# EAGLE design Spannungsversorgung_FinalVersion (EAGLE 9.6.2)
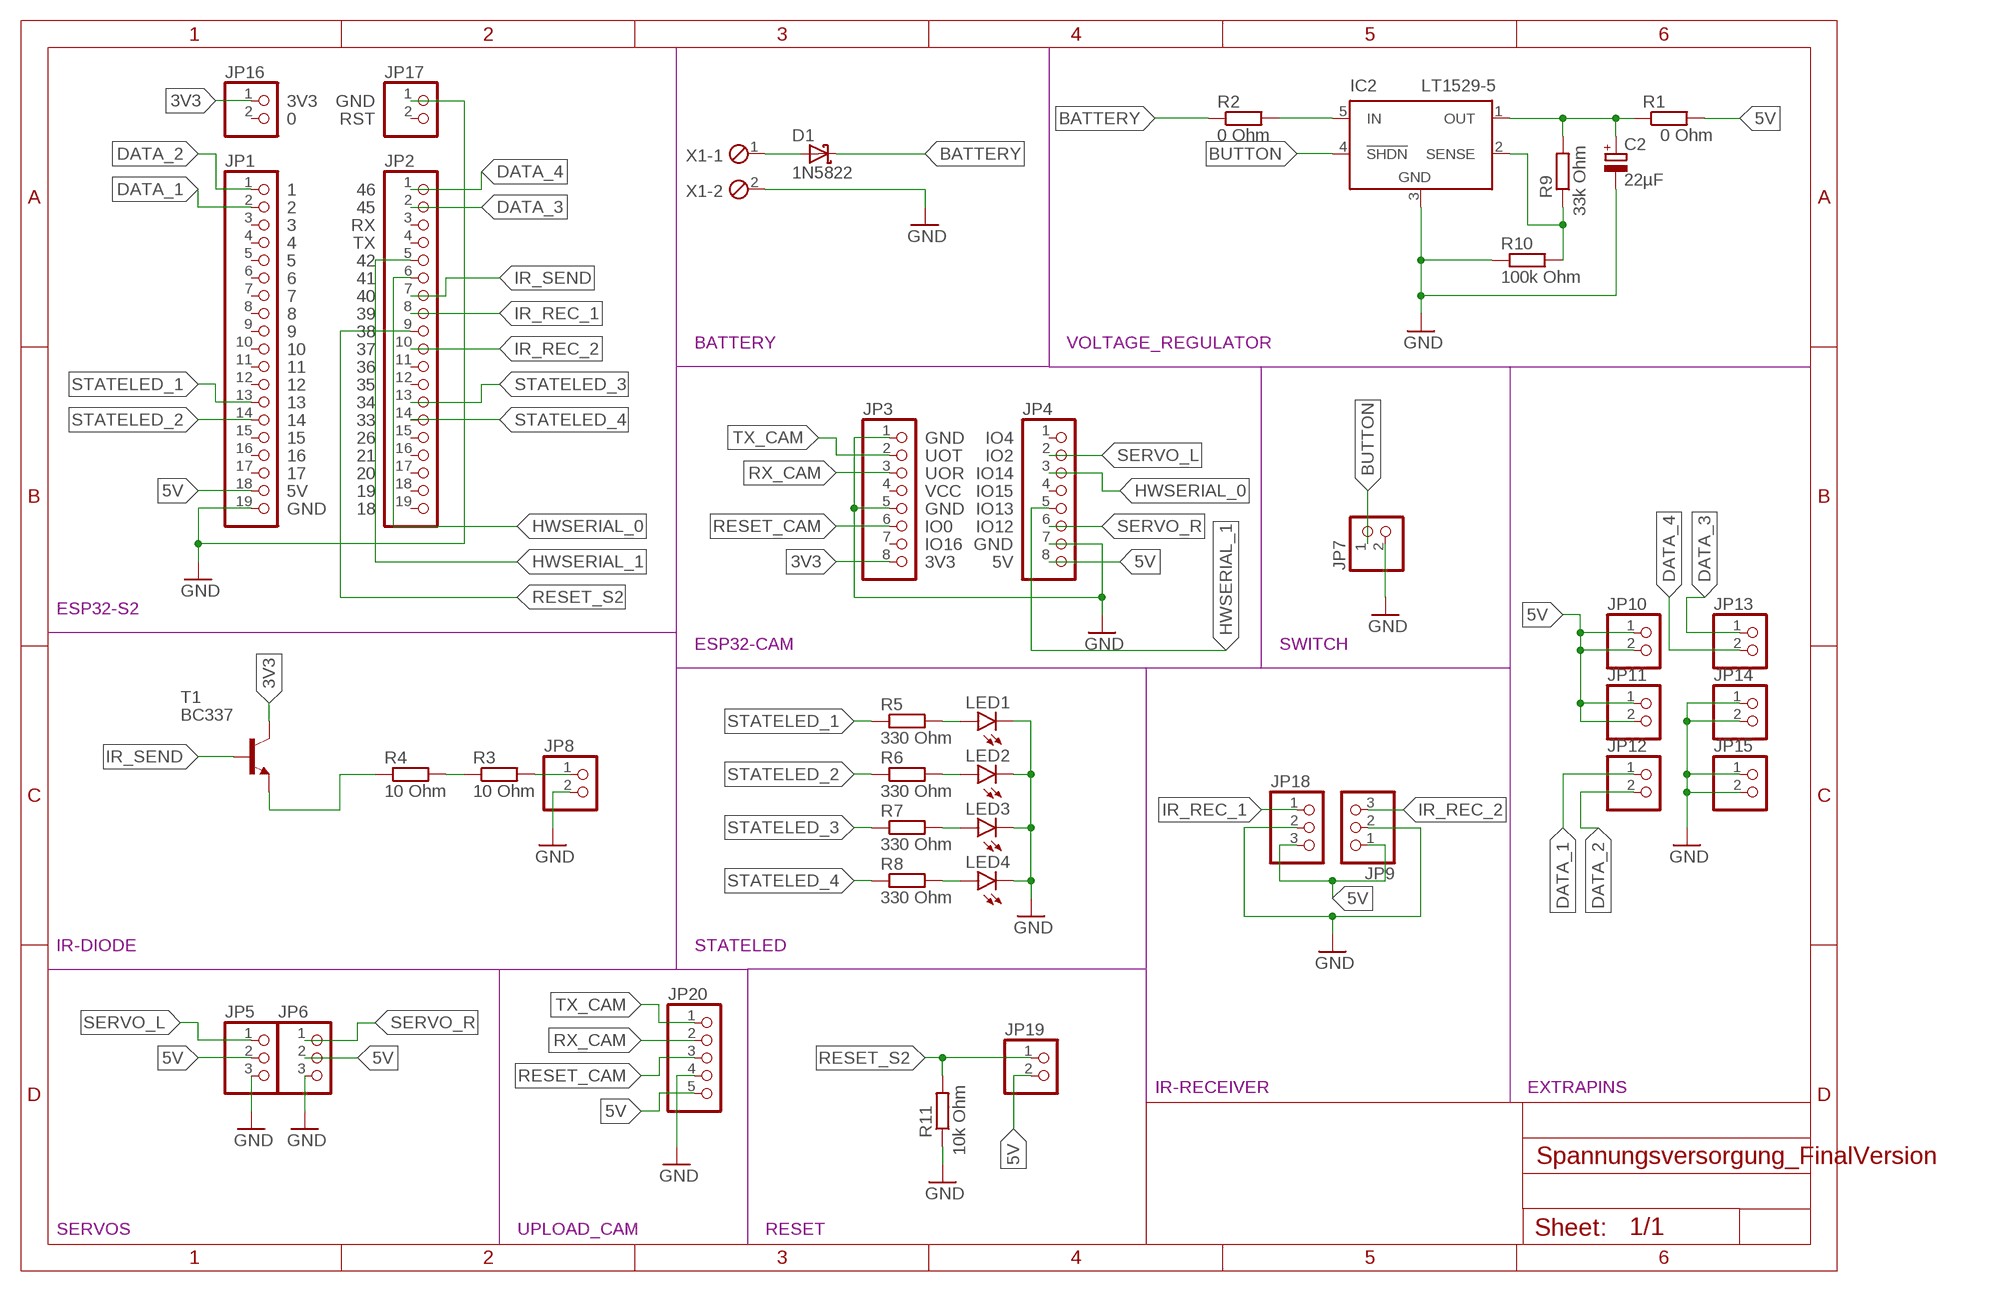
[diagram p0: schematic, sheet 1]

## Parts
C2  22µF  CPOL-EUE2.5-5  [E2,5-5]
D1  1N5822  [DIOAD2120W130L950D530P]
IC2  LT1529-5  LT1529T  [TO220-5]
JP1  PINHD-1X19  [1X19]
JP2  PINHD-1X19  [1X19]
JP3  PINHD-1X8  [1X08]
JP4  PINHD-1X8  [1X08]
JP5  PINHD-1X3  [1X03]
JP6  PINHD-1X3  [1X03]
JP7  PINHD-1X2  [1X02]
JP8  PINHD-1X2  [1X02]
JP9  PINHD-1X3  [1X03]
JP10  PINHD-1X2  [1X02]
JP11  PINHD-1X2  [1X02]
JP12  PINHD-1X2  [1X02]
JP13  PINHD-1X2  [1X02]
JP14  PINHD-1X2  [1X02]
JP15  PINHD-1X2  [1X02]
JP16  PINHD-1X2  [1X02]
JP17  PINHD-1X2  [1X02]
JP18  PINHD-1X3  [1X03]
JP19  PINHD-1X2  [1X02]
JP20  PINHD-1X5  [1X05]
LED1  LED3MM  [LED3MM]
LED2  LED3MM  [LED3MM]
LED3  LED3MM  [LED3MM]
LED4  LED3MM  [LED3MM]
R1  0 Ohm  R-EU_R0805  [R0805]
R2  0 Ohm  R-EU_R0805  [R0805]
R3  10 Ohm  R-EU_0309/12  [0309/12]
R4  10 Ohm  R-EU_0309/12  [0309/12]
R5  330 Ohm  R-EU_R0805  [R0805]
R6  330 Ohm  R-EU_R0805  [R0805]
R7  330 Ohm  R-EU_R0805  [R0805]
R8  330 Ohm  R-EU_R0805  [R0805]
R9  33k Ohm  R-EU_0309/12  [0309/12]
R10  100k Ohm  R-EU_0309/12  [0309/12]
R11  10k Ohm  R-EU_0309/12  [0309/12]
T1  BC337  [TO92]
X1  MPT2  [2POL254]

## Nets
3V3: JP3.8 JP16.1 T1.3(C)
5V: JP1.18 JP4.8 JP5.2 JP6.2 JP9.1 JP10.1 JP10.2 JP11.1 JP11.2 JP18.3 JP19.2 JP20.5 R1.2
BATTERY: D1.C R2.1
BUTTON: IC2.4(!SHDN) JP7.1
DATA_1: JP1.2 JP12.1
DATA_2: JP1.1 JP12.2
DATA_3: JP2.2 JP13.1
DATA_4: JP2.1 JP13.2
GND: C2.- IC2.3(GND) JP1.19 JP3.1 JP3.5 JP4.7 JP5.3 JP6.3 JP7.2 JP8.2 JP9.2 JP14.1 JP14.2 JP15.1 JP15.2 JP17.1 JP18.2 JP20.4 LED1.K(C) LED2.K(C) LED3.K(C) LED4.K(C) R10.1 R11.1 X1.2
HWSERIAL_0: JP2.6 JP4.3
HWSERIAL_1: JP2.5 JP4.5
IR_REC_1: JP2.8 JP18.1
IR_REC_2: JP2.10 JP9.3
IR_SEND: JP2.7 T1.2(B)
N$1: R3.1 R4.2
N$2: JP8.1 R3.2
N$3: IC2.5(IN) R2.2
N$4: D1.A X1.1
N$5: LED1.A R5.2
N$6: LED2.A R6.2
N$7: LED3.A R7.2
N$8: LED4.A R8.2
N$11: R4.1 T1.1(E)
N$13: IC2.2(SENSE) R9.1 R10.2
N$14: C2.+ IC2.1(OUT) R1.1 R9.2
RESET_CAM: JP3.6 JP20.3
RESET_S2: JP2.9 JP19.1 R11.2
RX_CAM: JP3.3 JP20.2
SERVO_L: JP4.2 JP5.1
SERVO_R: JP4.6 JP6.1
STATELED_1: JP1.13 R5.1
STATELED_2: JP1.14 R6.1
STATELED_3: JP2.13 R7.1
STATELED_4: JP2.14 R8.1
TX_CAM: JP3.2 JP20.1
Unconnected: JP1.3 JP1.4 JP1.5 JP1.6 JP1.7 JP1.8 JP1.9 JP1.10 JP1.11 JP1.12 JP1.15 JP1.16 JP1.17 JP2.3 JP2.4 JP2.11 JP2.12 JP2.15 JP2.16 JP2.17 JP2.18 JP2.19 JP3.4 JP3.7 JP4.1 JP4.4 JP16.2 JP17.2

## Notes on the sheet
- 3V3 | GND
- 0 | RST
- 1 | 46
- 2 | 45
- 3 | RX
- 4 | TX
- 5 | 42
- 6 | 41
- 7 | 40
- 8 | 39
- 9 | 38
- BATTERY | VOLTAGE_REGULATOR
- 10 | 37
- 11 | 36
- 12 | 35
- 13 | 34
- 14 | 33
- 15 | 26 | GND | IO4
- 16 | 21 | UOT | IO2
- 17 | 20 | UOR | IO14
- 5V | 19 | VCC | IO15
- GND | 18 | GND | IO13
- IO0 | IO12
- IO16 | GND
- 3V3 | 5V
- ESP32-S2
- ESP32-CAM | SWITCH
- IR-DIODE | STATELED
- IR-RECEIVER | EXTRAPINS
- SERVOS | UPLOAD_CAM | RESET

## Library data of the parts
C2 = rcl:CPOL-EU: POLARIZED CAPACITOR, European symbol; SPICEPREFIX: C
D1 = 1N5822:1N5822: 1N5822 Series 40 V 3 A Through Hole Schottky Rectifier - DO-201AD Check availability <https://pricing.snapeda.com/parts/1N5822/ON%20Semiconductor/view-part?ref=eda>; AVAILABILITY: In Stock; DESCRIPTION: DIODE, SCHOTTKY, 3A, 40V; Diode Type:Schottky; Diode Configuration:Single; Repetitive Reverse Voltage Vrrm Max:40V; Forward Current If(AV):3A; Forward Voltage VF Max:525mV; Forward Surge Current Ifsm Max:80A; Diode Case Style:DO-201AD; No. of Pins:2; SVHC:No SVHC (19-Dec-2011); Current Ifsm:80A; Device Marking:1N5822; Forward Current If Max:3A; Forward Voltage:525mV; Junction Temperature Tj Max:150°C; Package / Case:DO-201AD; RMS Current If:10A; Termination Type:Axial Leaded; MF: ON Semiconductor; MP: 1N5822; PACKAGE: AXIAL LEAD-2 ON Semiconductor; PRICE: None; PURCHASE-URL: https://pricing.snapeda.com/search/part/1N5822/?ref=eda
IC2 = ltc1440_lt1529_ds1302:LT1529: LT1529 5 Volt LDO Regulator 5 Volt, 3 Ampere Low Dropout voltage regulator.
JP1 JP2 = pinhead:PINHD-1X19: PIN HEADER
JP3 JP4 = pinhead:PINHD-1X8: PIN HEADER
JP5 JP6 JP9 JP18 = pinhead:PINHD-1X3: PIN HEADER
JP7 JP8 JP10-JP17 JP19 = pinhead:PINHD-1X2: PIN HEADER
JP20 = pinhead:PINHD-1X5: PIN HEADER
LED1-LED4 = led:LED: LED OSRAM: - CHIPLED LG R971, LG N971, LY N971, LG Q971, LY Q971, LO R971, LY R971 LH N974, LH R974 LS Q976, LO Q976, LY Q976 LO Q996 - Hyper CHIPLED LW Q18S LB Q993, LB Q99A, LB R99A - SideLED LS A670, LO A670, LY A670, LG A670, LP A670 LB A673, LV A673, LT A673, LW A673 LH A674 LY A675 LS A676, LA A676, LO A676, LY A676, LW A676 LS A679, LY A679, LG A679 - Hyper Micro SIDELED® LS Y876, LA Y876, LO Y876, LY Y876 LT Y87S - SmartLED LW L88C, LW L88S LB L89C, LB L89S, LG L890 LS L89K, LO L89K, LY L89K LS L896, LA L896, LO L896, LY L896 - TOPLED LS T670, LO T670, LY T670, LG T670, LP T670 LSG T670, LSP T670, LSY T670, LOP T670, LYG T670 LG T671, LOG T671, LSG T671 LB T673, LV T673, LT T673, LW T673 LH T674 LS T676, LA T676, LO T676, LY T676, LB T676, LH T676, LSB T676, LW T676 LB T67C, LV T67C, LT T67C, LS T67K, LO T67K, LY T67K, LW E67C LS E67B, LA E67B, LO E67B, LY E67B, LB E67C, LV E67C, LT E67C LW T67C LS T679, LY T679, LG T679 LS T770, LO T770, LY T770, LG T770, LP T770 LB T773, LV T773, LT T773, LW T773 LH T774 LS E675, LA E675, LY E675, LS T675 LS T776, LA T776, LO T776, LY T776, LB T776 LHGB T686 LT T68C, LB T68C - Hyper Mini TOPLED® LB M676 - Mini TOPLED Santana® LG M470 LS M47K, LO M47K, LY M47K Source: http://www.osram.convergy.de LUXEON: - LUMILED® LXK2-PW12-R00, LXK2-PW12-S00, LXK2-PW14-U00, LXK2-PW14-V00 LXK2-PM12-R00, LXK2-PM12-S00, LXK2-PM14-U00 LXK2-PE12-Q00, LXK2-PE12-R00, LXK2-PE12-S00, LXK2-PE14-T00, LXK2-PE14-U00 LXK2-PB12-K00, LXK2-PB12-L00, LXK2-PB12-M00, LXK2-PB14-N00, LXK2-PB14-P00, LXK2-PB14-Q00 LXK2-PR12-L00, LXK2-PR12-M00, LXK2-PR14-Q00, LXK2-PR14-R00 LXK2-PD12-Q00, LXK2-PD12-R00, LXK2-PD12-S00 LXK2-PH12-R00, LXK2-PH12-S00 LXK2-PL12-P00, LXK2-PL12-Q00, LXK2-PL12-R00 Source: www.luxeon.com KINGBRIGHT: KA-3528ASYC Source: www.kingbright.com
R1-R11 = rcl:R-EU_: RESISTOR, European symbol; SPICEPREFIX: R
T1 = transistor:BC337: NPN TRANSISTOR
X1 = con-phoenix-254:MPT2: PHOENIX CONNECTOR; OC_FARNELL: unknown; OC_NEWARK: unknown

## Board
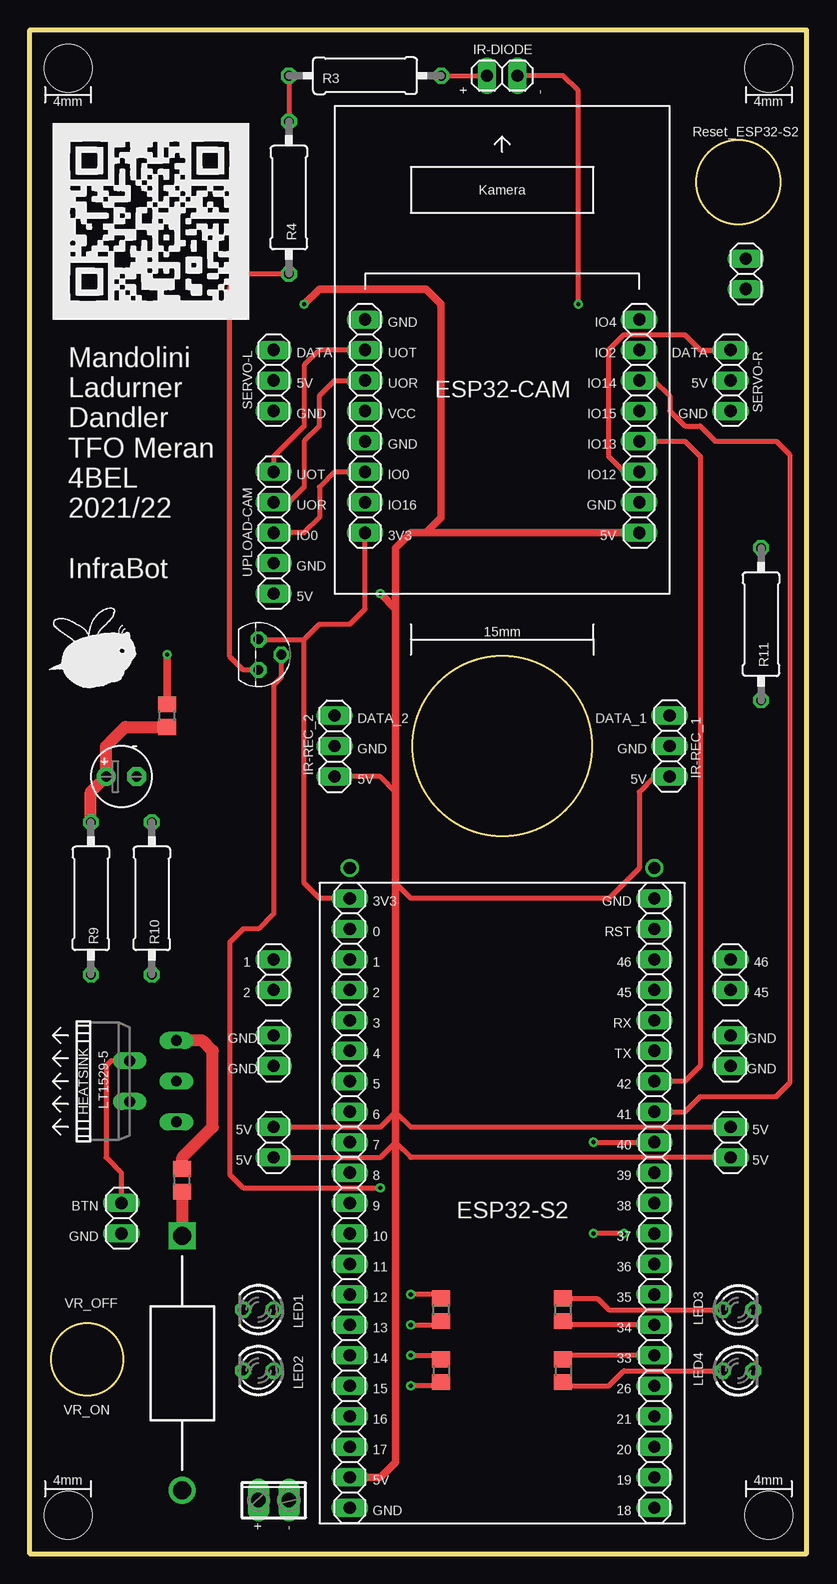
[diagram p1: board, top side]
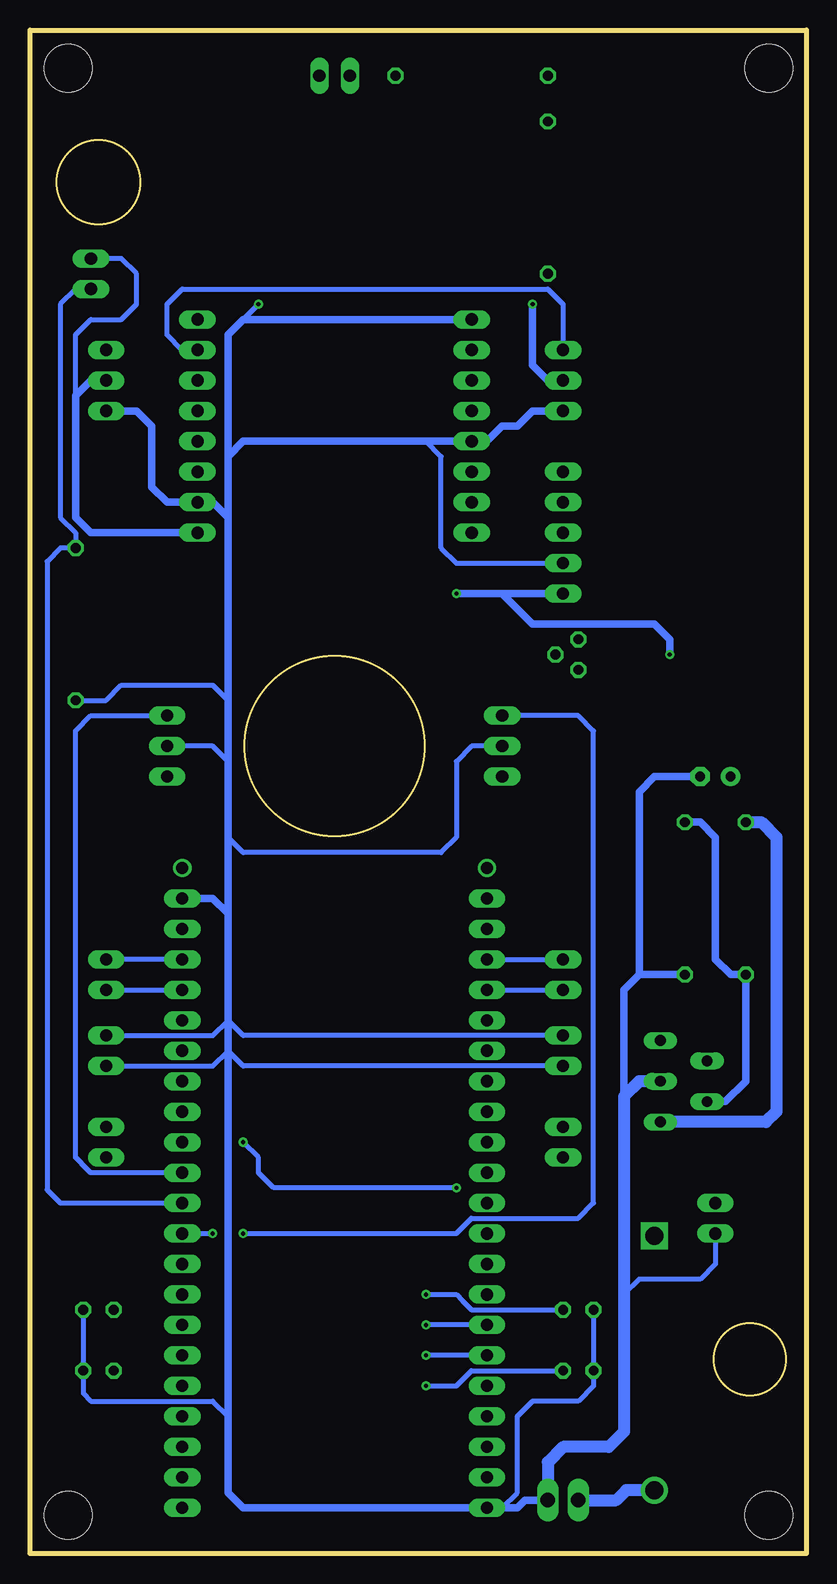
[diagram p2: board, bottom side, seen from below]

Size 64.77 x 127 mm. Coordinates in mm from the lower left corner, seen from the top.
Outline: 0,0 64.77,0 64.77,127 0,127 0,0
Copper layers (1*16): Top 0.035mm / dielectric 1.5mm / Bottom 0.035mm
Design rules "default *": minimum track width 6mil, minimum drill 0.35mm, track to track 12mil, track to pad 12mil, pad to pad 12mil, via to via 12mil, smd to smd 12mil, copper to edge 40mil, drill to drill 12mil, minimum pad ring 10mil, minimum via ring 8mil, stop-mask expansion 4mil, vias tented up to drill 0mil, thermal gap 10mil
Holes 4 mm at 3.18,123.82 61.59,123.82 3.18,3.17 61.59,3.17
Milling: area 31.9,59.8 to 46.9,74.8; area 1.8,13.2 to 7.8,19.2; area 55.6,110.8 to 62.6,117.8

### Footprints (pad centres in the part's own frame; a part is rotated, then mirrored left to right if it is on the bottom)
E2,5-5 = drill 0.813 pad 1.6: + -1.27,0 | drill 0.813 pad 1.6 octagon: - 1.27,0
DIOAD2120W130L950D530P = drill 1.5 pad 2.25: A 10.6,0 | drill 1.5 pad 2.25 square: C -10.6,0
TO220-5 = drill 0.9 long: 1 -3.4,-8.4; 2 -1.7,-4.5; 3 0,-8.4; 4 1.7,-4.5; 5 3.4,-8.4
1X19 = drill 1.016 long: 1 -22.86,0; 2 -20.32,0; 3 -17.78,0; 4 -15.24,0; 5 -12.7,0; 6 -10.16,0; 7 -7.62,0; 8 -5.08,0; 9 -2.54,0; 10 0,0; 11 2.54,0; 12 5.08,0; 13 7.62,0; 14 10.16,0; 15 12.7,0; 16 15.24,0; 17 17.78,0; 18 20.32,0; 19 22.86,0
1X08 = drill 1.016 long: 1 -8.89,0; 2 -6.35,0; 3 -3.81,0; 4 -1.27,0; 5 1.27,0; 6 3.81,0; 7 6.35,0; 8 8.89,0
1X03 = drill 1.016 long: 1 -2.54,0; 2 0,0; 3 2.54,0
1X02 = drill 1.016 long: 1 -1.27,0; 2 1.27,0
1X05 = drill 1.016 long: 1 -5.08,0; 2 -2.54,0; 3 0,0; 4 2.54,0; 5 5.08,0
LED3MM = drill 0.813 octagon: A -1.27,0; K 1.27,0
R0805 = smd 1.3 x 1.5: 1 -0.95,0; 2 0.95,0
0309/12 = drill 0.813 octagon: 1 -6.35,0; 2 6.35,0
TO92 = drill 0.813 octagon: 1 1.27,0; 2 0,1.905; 3 -1.27,0
2POL254 = drill 1.2 long: 1 -1.27,0; 2 1.27,0

### Placement (x,y rotation side)
C2  7.62,64.77 0 top
D1  12.7,15.88 270 top
IC2  3.81,39.37 90 top
JP1  26.67,26.67 270 top
JP2  52.07,26.67 270 top
JP3  27.94,93.98 270 top
JP4  50.8,93.98 270 top
JP5  20.32,97.79 270 top
JP6  58.42,97.79 270 top
JP7  7.62,27.94 270 top
JP8  39.37,123.19 0 top
JP9  25.4,67.31 90 top
JP10  20.32,34.29 90 top
JP11  58.42,34.29 90 top
JP12  20.32,48.26 90 top
JP13  58.42,48.26 90 top
JP14  20.32,41.91 90 top
JP15  58.42,41.91 90 top
JP16  26.67,53.34 270 top
JP17  52.07,53.34 270 top
JP18  53.34,67.31 270 top
JP19  59.69,106.68 90 top
JP20  20.32,85.09 270 top
LED1  19.05,20.32 180 top
LED2  19.05,15.24 180 top
LED3  59.05,20.32 0 top
LED4  59.05,15.24 0 top
R1  11.43,69.85 90 top
R2  12.69,31.12 90 top
R3  27.94,123.19 0 top
R4  21.59,113.03 90 top
R5  34.29,20.32 90 top
R6  34.29,15.24 270 top
R7  44.45,20.32 90 top
R8  44.45,15.24 270 top
R9  5.08,54.61 90 top
R10  10.16,54.61 90 top
R11  60.96,77.47 90 top
T1  19.05,74.93 270 top
X1  20.32,4.45 0 top

### Tracks (layer width: path | path; a pad name or v marks a point on that pad's centre or on a via)
3V3
  Top 0.406: 22.86,76.2 22.86,55.88 24.13,54.61 JP16.1 | 22.86,76.2 24.13,77.47 26.67,77.47 27.94,78.74 JP3.8 | T1.3 22.86,76.2
5V  (via drill 0.35)
  Top 0.406: JP10.2 29.21,35.56 30.48,36.83 31.75,35.56 JP11.2 | JP10.1 29.21,33.02 30.48,34.29 31.75,33.02 JP11.1 | 30.48,63.5 29.21,64.77 JP9.1 | 30.48,55.88 31.75,54.61 48.26,54.61 50.8,57.15 50.8,63.5 52.07,64.77 JP18.3
  Top 0.61: 33.02,85.09 31.75,85.09 30.48,83.82 30.48,78.74 | 33.02,85.09 JP4.8 | 30.48,78.74 30.48,63.5 30.48,55.88 30.48,36.83 30.48,34.29 30.48,7.62 29.21,6.35 JP1.18 | 33.02,85.09 34.29,86.36 34.29,104.14 33.02,105.41 24.13,105.41 v22.86,104.14 | 30.48,78.74 v29.21,80.01 | v11.43,74.93 R1.2
  Bottom 0.406: 60.96,96.52 60.96,101.6 59.69,102.87 57.15,102.87 55.88,104.14 55.88,106.68 57.15,107.95 JP19.2
  Bottom 0.61: JP6.2 59.69,97.79 60.96,96.52 60.96,86.36 59.69,85.09 JP4.8 | v22.86,104.14 22.86,99.06 21.59,97.79 JP5.2 | v29.21,80.01 25.4,80.01 | 25.4,80.01 JP20.5 | 25.4,80.01 22.86,77.47 12.7,77.47 11.43,76.2 v11.43,74.93
BATTERY
  Top 1.016: R2.1 12.7,30.15 D1.C
BUTTON
  Top 0.406: IC2.4 6.78,41.07 6.35,40.64 6.35,33.02 7.62,31.75 JP7.1
DATA_1
  Bottom 0.406: JP1.2 JP12.1
DATA_2
  Bottom 0.406: JP1.1 JP12.2
DATA_3
  Bottom 0.406: JP13.1 JP2.2
DATA_4
  Bottom 0.406: JP2.1 JP13.2
GND  (via drill 0.35)
  Top 0.406: v45.72,104.14 45.72,121.92 44.45,123.19 JP8.2
  Bottom 0.406: JP14.2 46.99,43.18 48.26,44.45 49.53,43.18 JP15.2 | JP14.1 46.99,40.64 48.26,41.91 49.53,40.64 JP15.1 | 48.26,66.04 49.53,67.31 JP18.2 | JP9.2 27.94,67.31 29.21,66.04 29.21,59.69 30.48,58.42 46.99,58.42 48.26,59.69 | LED1.K LED2.K 17.78,13.97 19.05,12.7 22.86,12.7 24.13,11.43 24.13,5.08 25.4,3.81 JP1.19 | LED3.K LED4.K 60.32,13.33 59.69,12.7 49.53,12.7 48.26,11.43 | JP3.5 26.67,92.71 | 31.75,92.71 30.48,91.44 30.48,83.82 29.21,82.55 JP20.4 | 46.99,102.87 v45.72,104.14 | 48.26,71.12 49.53,72.39 57.15,72.39 58.42,71.12 R11.1 | JP7.2 7.62,24.13 8.89,22.86 13.97,22.86 15.24,21.59
  Bottom 0.61: 48.26,86.36 49.53,87.63 JP4.7 53.34,87.63 54.61,88.9 54.61,93.98 55.88,95.25 JP6.3 | 48.26,86.36 48.26,71.12 48.26,66.04 48.26,59.69 48.26,53.34 | 48.26,53.34 48.26,44.45 48.26,41.91 48.26,11.43 48.26,5.08 46.99,3.81 JP1.19 24.13,3.81 23.5,4.45 X1.2 | JP17.1 49.53,54.61 48.26,53.34 | 48.26,91.44 48.26,101.6 46.99,102.87 JP3.1 | 48.26,91.44 48.26,86.36 | JP3.5 31.75,92.71 46.99,92.71 48.26,91.44 | 26.67,92.71 25.4,93.98 24.13,93.98 22.86,95.25 JP5.3 | 13.97,48.26 15.24,46.99 15.24,38.1 | R10.1 13.97,48.26 | C2.- 12.7,64.77 13.97,63.5 13.97,48.26
  Bottom 1.016: IC2.3 13.97,39.37 15.24,38.1 15.24,21.59 15.24,10.16 16.51,8.89 20.32,8.89 21.59,7.62 X1.2
HWSERIAL_0
  Top 0.406: JP2.6 54.61,36.83 55.88,38.1 62.23,38.1 63.35,39.22 63.35,91.59 62.23,92.71 57.15,92.71 55.88,93.98 54.61,93.98 53.34,95.25 53.34,96.52 52.07,97.79 JP4.3
HWSERIAL_1
  Top 0.406: JP4.5 54.61,92.71 55.88,91.44 55.88,40.64 54.61,39.37 JP2.5
IR_REC_1
  Bottom 0.406: JP18.1 59.69,69.85 60.96,68.58 60.96,33.02 60.45,32.51 60.45,32.49 59.71,31.75 JP2.8
IR_REC_2  (via drill 0.35)
  Top 0.406: v49.53,26.67 v46.99,26.67
  Bottom 0.406: JP2.10 v49.53,26.67 | v46.99,26.67 29.21,26.67 28.7,27.18 28.7,27.2 27.96,27.94 19.05,27.94 17.78,29.21 17.78,68.58 19.05,69.85 JP9.3
IR_SEND  (via drill 0.35)
  Top 0.406: T1.2 20.96,73.03 20.32,72.39 20.32,53.34 19.05,52.07 17.78,52.07 16.66,50.95 16.66,31.6 17.78,30.48 v29.21,30.48 | v46.99,34.29 JP2.7
  Bottom 0.406: v46.99,34.29 45.72,33.02 45.72,31.75 44.45,30.48 v29.21,30.48
N$1
  Top 0.406: R3.1 R4.2
N$2
  Top 0.406: R3.2 JP8.1
N$3
  Top 1.016: R2.2 12.7,33.02 15.24,35.56 15.24,41.91 14.38,42.77 IC2.5
N$4
  Bottom 1.016: D1.A 15.04,5.27 15.24,5.08 15.88,4.45 X1.1
N$5  (via drill 0.35)
  Top 0.406: R5.2 33.97,21.59 v31.75,21.59
  Bottom 0.406: v31.75,21.59 29.21,21.59 28.7,21.08 28.7,21.06 27.96,20.32 LED1.A
N$6  (via drill 0.35)
  Top 0.406: R6.2 33.97,13.97 v31.75,13.97
  Bottom 0.406: v31.75,13.97 29.21,13.97 28.7,14.48 28.7,14.5 27.96,15.24 LED2.A
N$7
  Top 0.406: R7.2 47.31,21.27 48.26,20.32 LED3.A
N$8
  Top 0.406: R8.2 44.77,13.97 48.26,13.97 49.53,15.24 LED4.A
N$9  (via drill 1.02)
  other vias: 52.07,57.15
N$10  (via drill 1.02)
  other vias: 26.67,57.15
N$11
  Top 0.406: T1.1 17.78,73.66 16.66,74.78 16.66,105.56 17.78,106.68 R4.1
N$13
  Bottom 0.61: IC2.2 6.78,37.67 5.08,39.37 R9.1 6.35,48.26 7.62,49.53 7.62,59.69 8.89,60.96 R10.2
N$14
  Top 1.016: R1.1 7.94,68.9 6.35,67.31 C2.+ 5.08,63.5 R9.2
  Bottom 1.016: R9.2 3.81,60.96 2.54,59.69 2.54,36.83 3.4,35.97 IC2.1
RESET_CAM
  Top 0.406: JP3.6 25.4,90.17 24.13,88.9 24.13,86.36 22.86,85.09 JP20.3
RESET_S2
  Bottom 0.406: JP19.1 60.96,105.41 62.23,104.14 62.23,86.36 60.96,85.09 R11.2 62.23,83.82 63.35,82.7 63.35,30.33 62.23,29.21 JP2.9
RX_CAM
  Top 0.406: JP3.3 25.4,97.79 24.13,96.52 24.13,93.98 22.86,92.71 22.86,88.9 21.59,87.63 JP20.2
SERVO_L
  Bottom 0.406: JP4.2 52.07,100.33 53.34,101.6 53.34,104.14 52.07,105.41 21.59,105.41 20.32,104.14 JP5.1
SERVO_R
  Top 0.406: JP4.6 49.53,90.17 48.26,91.44 48.26,100.35 49.51,101.6 54.61,101.6 55.88,100.33 JP6.1
STATELED_1  (via drill 0.35)
  Top 0.406: v31.75,19.05 33.97,19.05 R5.1
  Bottom 0.406: JP1.13 v31.75,19.05
STATELED_2  (via drill 0.35)
  Top 0.406: v31.75,16.51 33.97,16.51 R6.1
  Bottom 0.406: JP1.14 v31.75,16.51
STATELED_3
  Top 0.406: R7.1 44.77,19.05 JP2.13
STATELED_4
  Top 0.406: R8.1 44.77,16.51 JP2.14
TX_CAM
  Top 0.406: JP3.2 24.13,100.33 22.86,99.06 22.86,93.98 20.32,91.44 JP20.1

### Text on the board
tPlace: ESP32-CAM | ESP32-S2
tNames: IR-DIODE | + | - | 4mm | 4mm | Reset_ESP32-S2 | Kamera | GND | IO4 | DATA | UOT | IO2 | DATA | 5V | UOR | IO14 | 5V | SERVO-L | GND | VCC | IO15 | GND | SERVO-R | GND | IO13 | UOT | IO0 | IO12 | UOR | IO16 | GND | IO0 | 3V3 | 5V | GND | Mandolini / Ladurner / Dandler / TFO Meran / 4BEL / 2021/22 / / InfraBot | UPLOAD-CAM | 5V | 15mm | IR-REC_1 | DATA_2 | DATA_1 | GND | GND | IR-REC_2 | 5V | 5V | 3V3 | GND | 0 | RST | 1 | 1 | 46 | 46 | 2 | 2 | 45 | 45 | 3 | RX | GND | GND | 4 | TX | GND | GND | HEATSINK | 5 | 42 | 6 | 41 | 5V | 5V | 7 | 40 | 5V | 5V | 8 | 39 | BTN | 9 | 38 | GND | 10 | 37 | 11 | 36 | VR_OFF | 12 | 35 | 13 | 34 | 14 | 33 | 15 | 26 | VR_ON | 16 | 21 | 17 | 20 | 4mm | 5V | 19 | 4mm | GND | 18 | + | -